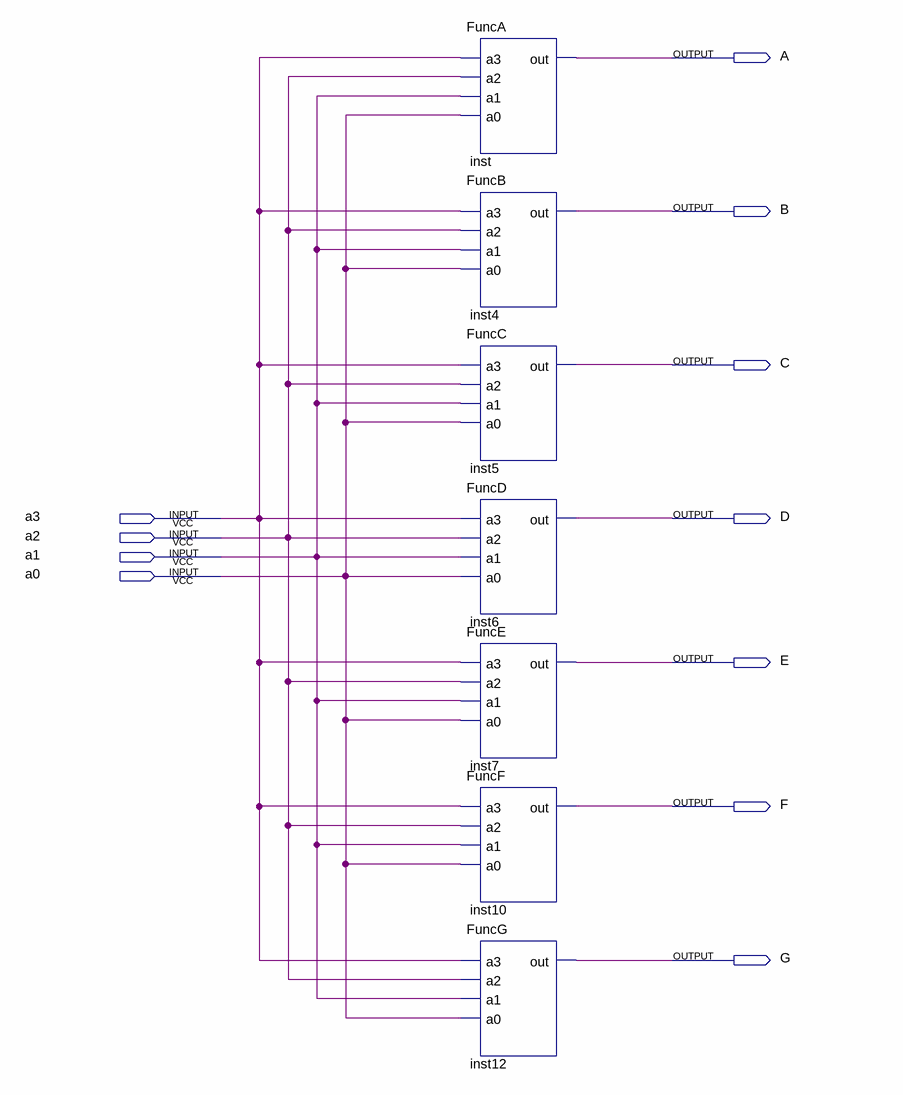
[diagram p0: schematic sheet]
// Quartus schematic lab05.bdf as structural Verilog: 7 symbols, 11 pins
module lab05 (
  input  a3,
  input  a2,
  input  a1,
  input  a0,
  output A,
  output B,
  output C,
  output D,
  output E,
  output F,
  output G
);

  FuncA inst (.a3(a3), .a2(a2), .a1(a1), .a0(a0), .out(A));
  FuncB inst4 (.a3(a3), .a2(a2), .a1(a1), .a0(a0), .out(B));
  FuncC inst5 (.a3(a3), .a2(a2), .a1(a1), .a0(a0), .out(C));
  FuncD inst6 (.a3(a3), .a2(a2), .a1(a1), .a0(a0), .out(D));
  FuncE inst7 (.a3(a3), .a2(a2), .a1(a1), .a0(a0), .out(E));
  FuncF inst10 (.a3(a3), .a2(a2), .a1(a1), .a0(a0), .out(F));
  FuncG inst12 (.a3(a3), .a2(a2), .a1(a1), .a0(a0), .out(G));
endmodule
